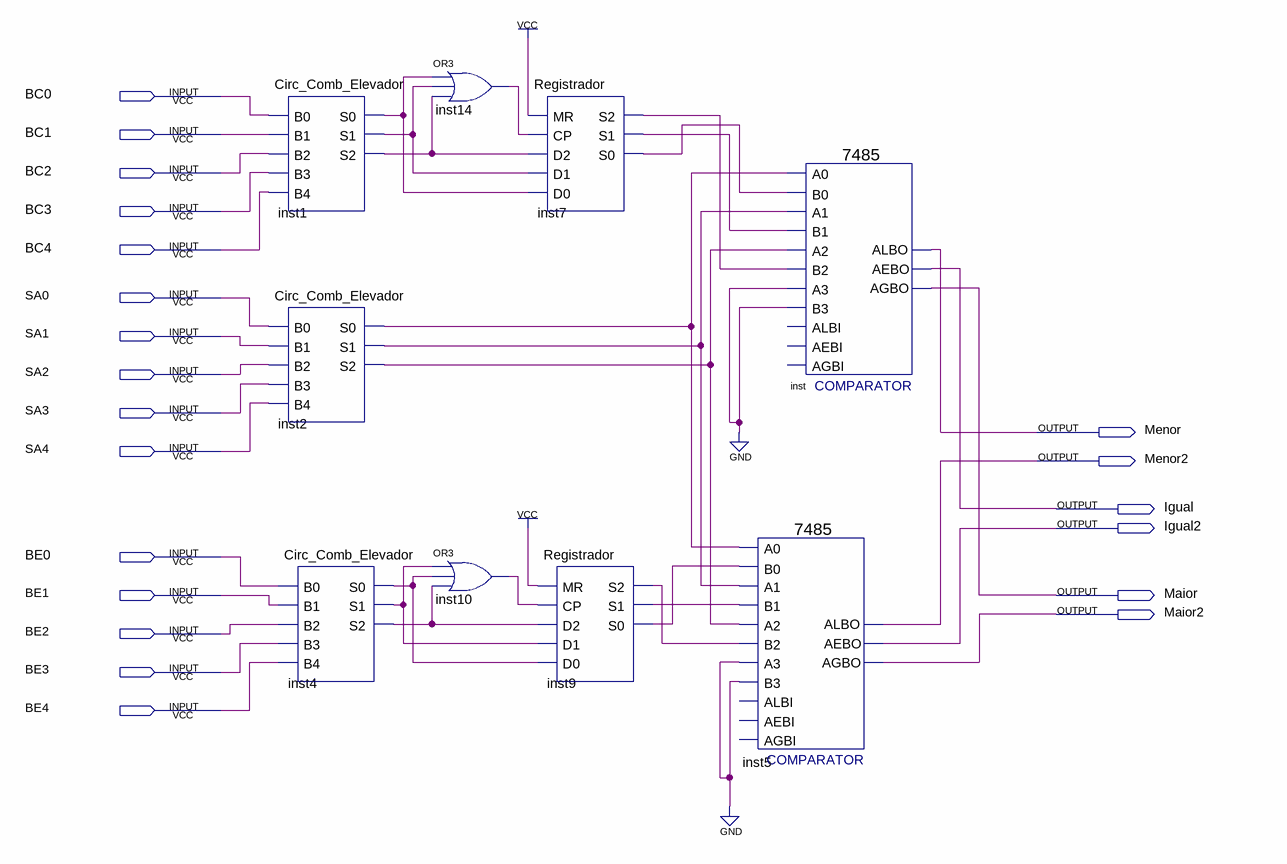
[diagram p0: schematic sheet]
// Quartus schematic Comparador.bdf as structural Verilog: 9 symbols, 21 pins
module Comparador (
  input  BC0,
  input  BC1,
  input  BC2,
  input  BC3,
  input  BC4,
  input  SA0,
  input  SA1,
  input  SA2,
  input  SA3,
  input  SA4,
  input  BE0,
  input  BE1,
  input  BE2,
  input  BE3,
  input  BE4,
  output Menor,
  output Menor2,
  output Igual,
  output Igual2,
  output Maior,
  output Maior2
);

  wire inst1_s0, inst1_s1, inst1_s2, inst2_s0, inst2_s1, inst2_s2, inst4_s0, inst4_s1, inst4_s2, inst7_s0,
       inst7_s1, inst7_s2, inst9_s0, inst9_s1, inst9_s2, inst10_out, inst14_out;

  Circ_Comb_Elevador inst1 (
    .B0(BC0), .B1(BC1), .B2(BC2), .B3(BC3), .B4(BC4), .S0(inst1_s0), .S1(inst1_s1), .S2(inst1_s2));
  Circ_Comb_Elevador inst2 (
    .B0(SA0), .B1(SA1), .B2(SA2), .B3(SA3), .B4(SA4), .S0(inst2_s0), .S1(inst2_s1), .S2(inst2_s2));
  Circ_Comb_Elevador inst4 (
    .B0(BE0), .B1(BE1), .B2(BE2), .B3(BE3), .B4(BE4), .S0(inst4_s0), .S1(inst4_s1), .S2(inst4_s2));
  or inst14 (inst14_out, inst1_s0, inst1_s1, inst1_s2);
  or inst10 (inst10_out, inst4_s1, inst4_s0, inst4_s2);
  Registrador inst7 (
    .MR(1'b1), .CP(inst14_out), .D2(inst1_s2), .D1(inst1_s1), .D0(inst1_s0), .S2(inst7_s2), .S1(inst7_s1),
    .S0(inst7_s0));
  Registrador inst9 (
    .MR(1'b1), .CP(inst10_out), .D2(inst4_s2), .D1(inst4_s1), .D0(inst4_s0), .S2(inst9_s2), .S1(inst9_s1),
    .S0(inst9_s0));
  \7485  inst5 (
    .A3(1'b0), .B2(inst9_s2), .A2(inst2_s2), .A0(inst2_s0), .B0(inst9_s0), .B3(1'b0), .A1(inst2_s1),
    .B1(inst9_s1), .ALBO(Menor2), .AGBO(Maior2), .AEBO(Igual2));  // open: AEBI, AGBI, ALBI
  \7485  inst (
    .A0(inst2_s0), .A1(inst2_s1), .A2(inst2_s2), .A3(1'b0), .B0(inst7_s0), .B1(inst7_s1), .B2(inst7_s2),
    .B3(1'b0), .AEBO(Igual), .AGBO(Maior), .ALBO(Menor));  // open: AEBI, AGBI, ALBI
endmodule
